# Altium schematic sheet WIRE CONVERTER.SchDoc: WIRE CONVERTER
size A4; Date: 01/01/2000; Author: Rachid AKKOUCHE; CompanyName: RASoftware; DrawnBy: Rachid AKKOUCHE; Engineer: Rachid AKKOUCHE; Organization: RASoftware; Address1: 52J-03 rue de la crèche; Address3: 77100 MEAUX; Address4: FRANCE; DocumentNumber: 01; Revision: A; SheetNumber: 1; SheetTotal: 1; Dessinepar: Rachid AKKOUCHE; Property: RASoftware; Time: 00:00; ProjectName: Projet BRA; Application_BuildNumber: 01
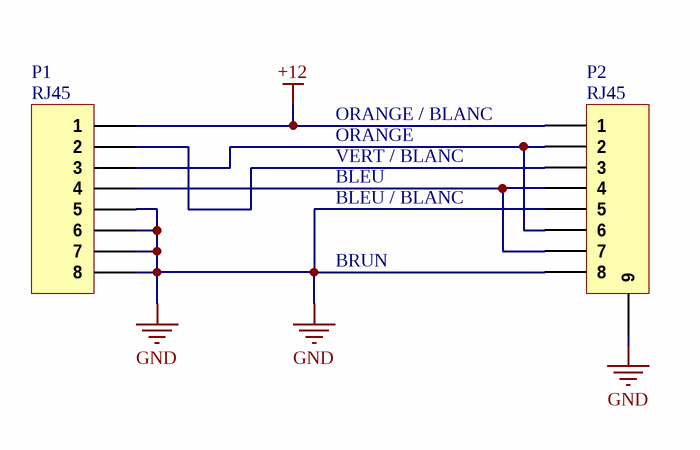
[diagram p0: WIRE CONVERTER.SchDoc]

## Parts
P1  RJ45  [Amphenol-RJ45_8]
P2  RJ45  [AMPHENOL-RJ45_8]

## Nets
+12: P1.1 P2.1
GND: P1.5 P1.6 P1.7 P1.8 P2.5 P2.8 P2.9
NetP1_2: P1.2 P2.3
NetP1_3: P1.3 P2.2 P2.6
NetP1_4: P1.4 P2.4 P2.7

## Notes on the sheet
- ORANGE / BLANC
- VERT / BLANC
- ORANGE
- BLEU
- BLEU / BLANC
- BRUN
- Ce document est la propriété de
- Project:
- Il ne peut être divulgué sans l'accord écrit de l'un de ses représentants dûment mandaté
- Title:
- Number:
- Date:
- Time:
- Size:
- A4
- Revision:
- Sheet
- of
- 52 J03 rue de la crèche
- Draw by:
- 77100 Meaux

## Library data of the parts
P1 = Header 8: Header, 8-Pin; Manufacturer: MOLEX; Manufacturer Part Number: 85502-5008; Supplier 1: Farnell; Supplier Part Number 1: 1331561; RoHS: YES; Pricing 1: 1=1,34, 10=0,873, 50=0,797, 100=0,662, 200=0,597, 500=0,541, 500=0,496, 5000=0,493 (EUR); ComponentLink1URL: http://www.farnell.com/cad/1712028.pdf; ComponentLink1Description: http://www.farnell.com/cad/1712028.pdf; ComponentLink2URL: http://www.farnell.com/datasheets/1827260.pdf; ComponentLink2Description: http://www.farnell.com/datasheets/1827260.pdf
P2 = Header 8: Header, 8-Pin; Manufacturer: MOLEX; Manufacturer Part Number: 85513-5013; Genre: Embase; Nombre de contacts: 8; Nombre de ports: 1; Catégorie LAN: Cat3; Terminaison du contact: Montage en surface vertical; Plaquage du contact: Or; Matériau du contact: Bronze phosphoreux; Approval Category: UL 94V-0; Couleur: Black; Courant: 1.5; Force diélectrique, Vca: 1000; Inflammabilité: UL94V-0; Largeur (externe): 15.9; Longueur/hauteur: 13; Matière: Glass Filled LCP; Profondeur: 18.8; Résistance d'isolement: 500; Résistance, contact: 20; Température de fonctionnement max..: 80; Température d'utilisation min: -40; Tension c.a.: 125; Supplier 1: Farnell; Supplier Part Number 1: 1345055; RoHS: YES; Pricing 1: 1=0,98, 10=0,92, 50=0,86, 100=0,74 (EUR); Type de connecteur: RJ45; Nombre de positions: 8; Body Plating: Or; Nombre de voies: 8; ComponentLink1URL: http://www.farnell.com/cad/1734187.pdf; ComponentLink1Description: http://www.farnell.com/cad/1734187.pdf; ComponentLink2URL: http://www.farnell.com/datasheets/1733622.pdf; ComponentLink2Description: http://www.farnell.com/datasheets/1733622.pdf